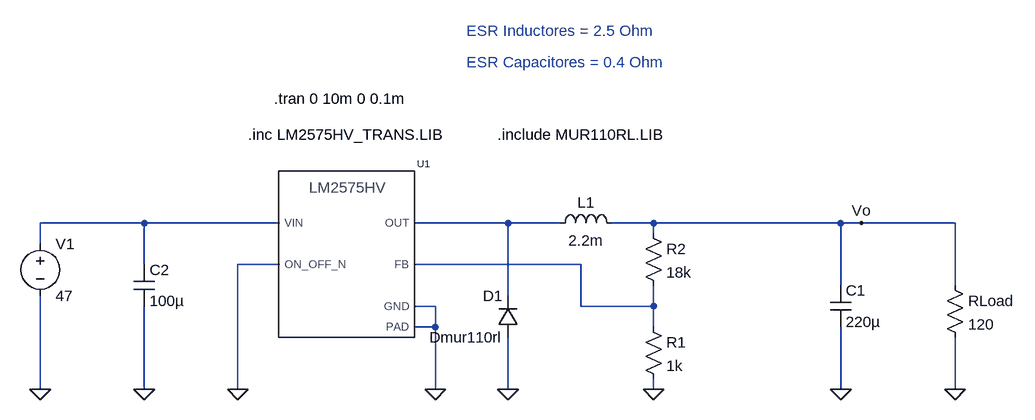
[diagram p0: schematic Fuente24V.asc]
Fuente24V.asc, the LTspice schematic file:
Version 4
SHEET 1 1280 680
WIRE -112 128 -272 128
WIRE 96 128 -112 128
WIRE 448 128 304 128
WIRE 528 128 448 128
WIRE 672 128 608 128
WIRE 960 128 672 128
WIRE 992 128 960 128
WIRE 1136 128 992 128
WIRE 672 144 672 128
WIRE -272 160 -272 128
WIRE -112 192 -112 128
WIRE 96 192 32 192
WIRE 560 192 304 192
WIRE 960 224 960 128
WIRE 1136 224 1136 128
WIRE 448 240 448 128
WIRE 336 256 304 256
WIRE 560 256 560 192
WIRE 672 256 672 224
WIRE 672 256 560 256
WIRE 336 288 336 256
WIRE 336 288 304 288
WIRE 672 288 672 256
WIRE -272 384 -272 240
WIRE -112 384 -112 256
WIRE 32 384 32 192
WIRE 336 384 336 288
WIRE 448 384 448 304
WIRE 672 384 672 368
WIRE 960 384 960 288
WIRE 1136 384 1136 304
FLAG 32 384 0
FLAG -112 384 0
FLAG -272 384 0
FLAG 336 384 0
FLAG 448 384 0
FLAG 672 384 0
FLAG 960 384 0
FLAG 1136 384 0
FLAG 992 128 Vo
SYMBOL LM2575HV 208 160 R0
SYMATTR InstName U1
SYMATTR Prefix X
SYMATTR Value LM2575HV_TRANS
SYMBOL voltage -272 144 R0
WINDOW 123 0 0 Left 0
WINDOW 39 0 0 Left 0
SYMATTR InstName V1
SYMATTR Value 47
SYMBOL ind 512 144 R270
WINDOW 0 32 56 VTop 2
WINDOW 3 5 56 VBottom 2
SYMATTR InstName L1
SYMATTR Value 2.2m
SYMATTR SpiceLine Rser=2.5
SYMBOL res 656 272 R0
SYMATTR InstName R1
SYMATTR Value 1k
SYMBOL res 656 128 R0
SYMATTR InstName R2
SYMATTR Value 18k
SYMBOL res 1120 208 R0
SYMATTR InstName RLoad
SYMATTR Value 120
SYMBOL cap 944 224 R0
SYMATTR InstName C1
SYMATTR Value 220µ
SYMATTR SpiceLine Rser=0.4
SYMBOL cap -128 192 R0
SYMATTR InstName C2
SYMATTR Value 100µ
SYMATTR SpiceLine Rser=0.4
SYMBOL diode 464 304 R180
WINDOW 0 24 64 Left 2
WINDOW 3 24 0 Left 2
SYMATTR InstName D1
SYMATTR Value Dmur110rl
TEXT 48 -8 Left 2 !.inc LM2575HV_TRANS.LIB
TEXT 88 -64 Left 2 !.tran 0 10m 0 0.1m
TEXT 432 -8 Left 2 !.include MUR110RL.LIB
TEXT 384 -168 Left 2 ;ESR Inductores = 2.5 Ohm
TEXT 384 -120 Left 2 ;ESR Capacitores = 0.4 Ohm

The netlist it stands for:
* Fuente24V.asc
XU1 N001 N002 0 N003 0 0 LM2575HV params: LM2575HV_TRANS  ; pins VIN OUT ON_OFF_N FB GND PAD
V1 N001 0 47
L1 N002 Vo 2.2m Rser=2.5
R1 N003 0 1k
R2 Vo N003 18k
RLoad Vo 0 120
C1 Vo 0 220µ Rser=0.4
C2 N001 0 100µ Rser=0.4
D1 0 N002 Dmur110rl
.model D D
.lib standard.dio
.inc LM2575HV_TRANS.LIB
.tran 0 10m 0 0.1m
.include MUR110RL.LIB
* ESR Inductores = 2.5 Ohm
* ESR Capacitores = 0.4 Ohm
.backanno
.end